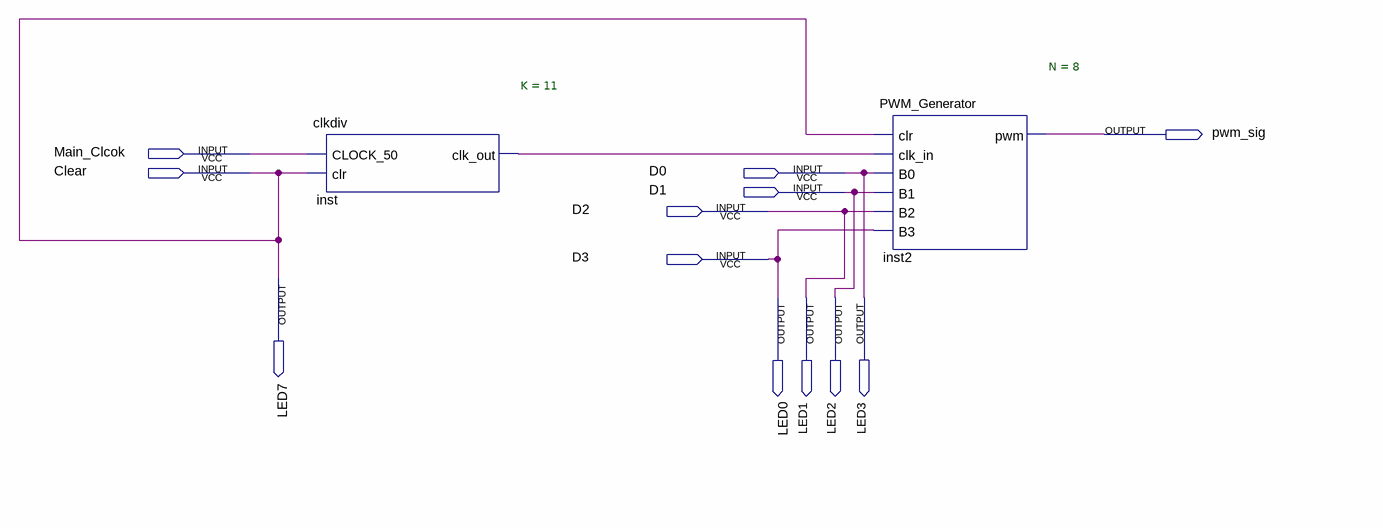
[diagram p0: schematic sheet]
// Quartus schematic PWM_Control.bdf as structural Verilog: 2 symbols, 12 pins
module PWM_Control (
  input  Main_Clcok,
  input  Clear,
  input  D0,
  input  D1,
  input  D2,
  input  D3,
  output pwm_sig,
  output LED7,
  output LED0,
  output LED1,
  output LED2,
  output LED3
);

  wire inst_clk_out;

  clkdiv #(.K(11)) inst (.CLOCK_50(Main_Clcok), .clr(Clear), .clk_out(inst_clk_out));
  PWM_Generator #(.N(8)) inst2 (.clr(Clear), .clk_in(inst_clk_out), .B0(D0), .B1(D1), .B2(D2), .B3(D3), .pwm(pwm_sig));

  assign LED0 = D3;
  assign LED1 = D2;
  assign LED2 = D1;
  assign LED3 = D0;
  assign LED7 = Clear;
endmodule
